# Altium project PCB_Trex2.PrjPcb
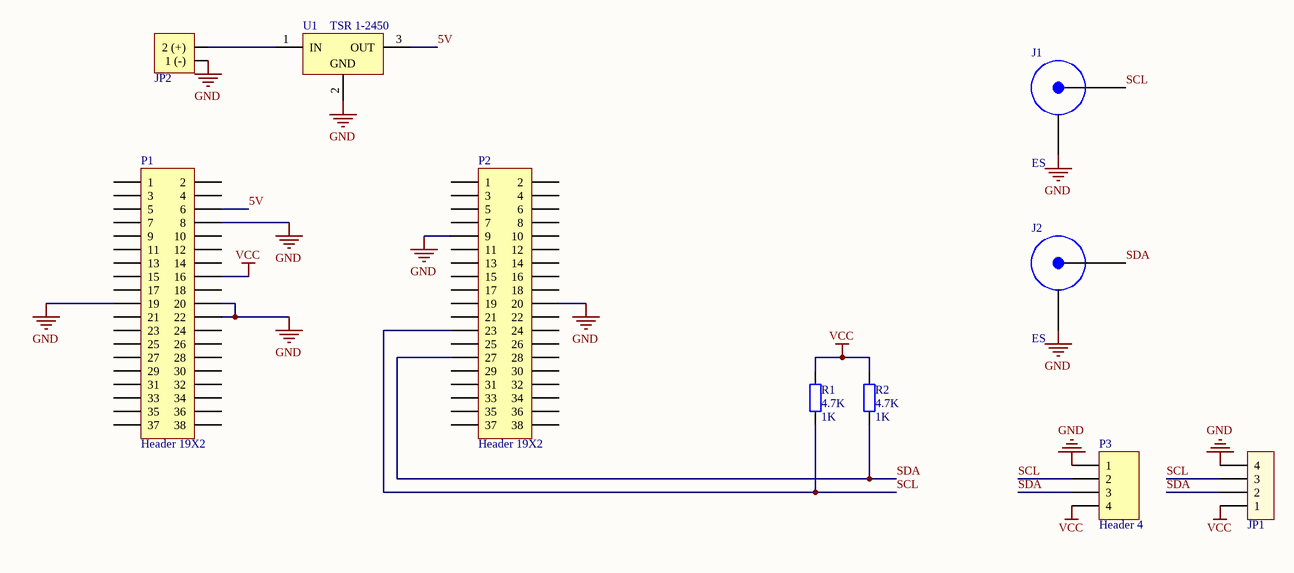
[diagram p0: Trex.SchDoc]
1 sheet, 10 parts. Net scope: global (net labels, ports and power ports of the same name join across sheets).
Board file: PCB_Trex.PcbDoc

## Sheet Trex.SchDoc
size A4

### Parts
J1  ES  [BNC]
J2  ES  [BNC]
JP1  Connecteur Autocom 4pts  [Autocom HE14 - 4 - Coudé]  (value not drawn)
JP2  Connecteur alim 2 pts  [entrelec 2 PTS]  (value not drawn)
P1  Header 19X2  [HDR2X19]
P2  Header 19X2  [HDR2X19]
P3  Header 4  [HDR1X4]
R1  4.7K  value 1K  [AXIAL-0.4]
R2  4.7K  value 1K  [AXIAL-0.4]
U1  TSR 1-2450  [TSR-1]

### Nets
GND: J1.2(GND) J2.2(GND) JP1.4 JP2.1(1_(-)) P1.8 P1.19 P1.20 P1.22 P2.9 P2.20 P3.1 U1.2(GND)
VCC: JP1.1 P1.16 P3.4 R1.2 R2.2
5V: P1.6 U1.3(OUT)
SCL: J1.1(SIGNAL) JP1.3 P2.23 P3.2 R1.1
SDA: J2.1(SIGNAL) JP1.2 P2.27 P3.3 R2.1
NetJP2_2: JP2.2(2_(+)) U1.1(IN)

Not connected (* = marked no-connect by the designer): P1 1 2 3 4 5 7 9 10 11 12 13 14 15 17 18 21 23 24 25 26 27 28 29 30 31 32 33 34 35 36 37 38; P2 1 2 3 4 5 6 7 8 10 11 12 13 14 15 16 17 18 19 21 22 24 25 26 28 29 30 31 32 33 34 35 36 37 38

### Library data of the parts
J1 J2 = BNC
JP1 = Connecteur Autocom 4 pts: connecteur autocom HE14 4 pts; Manufacturer: TE CONNECTIVITY / AMP; Manufacturer Part Number: 281698-4; Supplier 1: Farnell; RoHS: YES; Stock 1: 5967; Pricing 1: 5=0,55, 100=0,53, 250=0,45 (EUR); ComponentLink1URL: http://www.tycoelectronics.com/commerce/DocumentDelivery/DDEController?Action=srchrtrv&DocNm=CVM_281698-4&DocType=Customer+View+Model&DocLang=3D; ComponentLink1Description: http://www.tycoelectronics.com/commerce/DocumentDelivery/DDEController?Action=srchrtrv&DocNm=CVM_281698-4&DocType=Customer+View+Model&DocLang=3D; ComponentLink2URL: http://www.tycoelectronics.com/commerce/DocumentDelivery/DDEController?Action=srchrtrv&DocNm=281698&DocType=Customer+Drawing&DocLang=English; ComponentLink2Description: http://www.tycoelectronics.com/commerce/DocumentDelivery/DDEController?Action=srchrtrv&DocNm=281698&DocType=Customer+Drawing&DocLang=English; ComponentLink3URL: http://www.tycoelectronics.com/commerce/DocumentDelivery/DDEController?Action=srchrtrv&DocNm=108-15053&DocType=Specification+Or+Standard&DocLang=French; ComponentLink3Description: http://www.tycoelectronics.com/commerce/DocumentDelivery/DDEController?Action=srchrtrv&DocNm=108-15053&DocType=Specification+Or+Standard&DocLang=French; ComponentLink4URL: http://www.farnell.com/datasheets/23840.pdf; ComponentLink4Description: http://www.farnell.com/datasheets/23840.pdf; Supplier Part Number 1: 1205992
P1 P2 = Header 19X2: Header, 19-Pin, Dual row; LatestRevisionDate: 17-Jul-2002; LatestRevisionNote: Re-released for DXP Platform.; Publisher: Altium Limited
P3 = Header 4: Header, 4-Pin; LatestRevisionDate: 17-Jul-2002; LatestRevisionNote: Re-released for DXP Platform.; Publisher: Altium Limited
R1 R2 = Res2: Resistor; Published: 8-Jun-2000; LatestRevisionDate: 17-Jul-2002; LatestRevisionNote: Re-released for DXP Platform.; PackageReference: AXIAL-0.4; Publisher: Altium Limited; PackageDescription: Axial Device, Thru-Hole; 2 Leads; 0.4 in Pin Spacing
U1 = TSR 1-2450: DC/DC Converters  TSR-1 Series, 1 A; Manufacturer: TRACOPOWER; DC / DC Converter O/P Type: Fixed; Tension d'entrée: 6.5V DC à 36; Tension, sortie: 5.0; Courant, sortie: 1; Type de convertisseur DC / DC: SIP; Convertisseur DC / DC de montage: Traversant; Tension, entrée max..: 36; Tension, entrée min.: 6.5; Type de montage: PCB; Publisher: H.Angelis; Supplier 1: Farnell; Supplier Part Number 1: 1696320; Manufacturer Part Number: TSR 1-2450; RoHS: YES; Stock 1: 3108; Pricing 1: 1=8,45, 5=7,66, 10=7,43, 25=7,21 (EUR); ComponentLink1URL: http://www.farnell.com/datasheets/574984.pdf; ComponentLink1Description: http://www.farnell.com/datasheets/574984.pdf